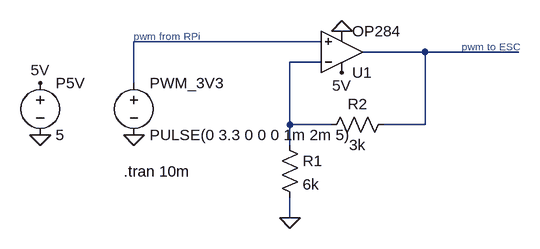
[diagram p0: schematic PWM_Signal_Amplifier_Circuit.asc]
PWM_Signal_Amplifier_Circuit.asc, the LTspice schematic file:
Version 4
SHEET 1 880 680
WIRE 160 128 -128 128
WIRE 320 144 224 144
WIRE 464 144 320 144
WIRE 160 160 112 160
WIRE -128 192 -128 128
WIRE 112 256 112 160
WIRE 176 256 112 256
WIRE 320 256 320 144
WIRE 320 256 256 256
WIRE 112 288 112 256
WIRE 112 400 112 368
FLAG -128 272 0
FLAG -272 272 0
FLAG -272 192 5V
FLAG 192 176 5V
FLAG 192 112 0
FLAG 112 400 0
SYMBOL Opamps\\OP284 192 208 M180
SYMATTR InstName U1
SYMBOL voltage -272 176 R0
SYMATTR InstName P5V
SYMATTR Value 5
SYMBOL voltage -128 176 R0
WINDOW 123 0 0 Left 0
WINDOW 39 0 0 Left 0
SYMATTR InstName PWM_3V3
SYMATTR Value PULSE(0 3.3 0 0 0 1m 2m 5)
SYMBOL res 96 272 R0
SYMATTR InstName R1
SYMATTR Value 6k
SYMBOL res 272 240 R90
WINDOW 0 0 56 VBottom 2
WINDOW 3 32 56 VTop 2
SYMATTR InstName R2
SYMATTR Value 3k
TEXT -128 120 Left 1 ;pwm from RPi
TEXT 376 136 Left 1 ;pwm to ESC
TEXT -144 328 Left 2 !.tran 10m

The netlist it stands for:
* PWM_Signal_Amplifier_Circuit.asc
XU1 N001 N003 5V 0 N002 OP284  ; pins In+ In- V+ V- OUT
V§P5V 5V 0 5
V§PWM_3V3 N001 0 PULSE(0 3.3 0 0 0 1m 2m 5)
R1 N003 0 6k
R2 N002 N003 3k
* pwm from RPi
* pwm to ESC
.tran 10m
.lib ADI1.lib
.backanno
.end